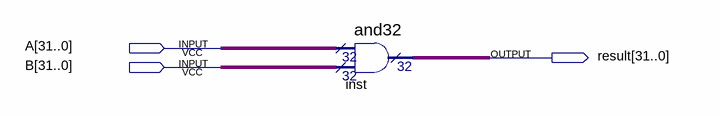
[diagram p0: schematic sheet]
// Quartus schematic and32.bdf as structural Verilog: 1 symbols, 3 pins
module and32 (
  input  [31:0] A,
  input  [31:0] B,
  output [31:0] result
);

  and32 inst (.data0x(A), .data1x(B), .result(result));
endmodule
